# Altium project ESP-3D.PrjPcb
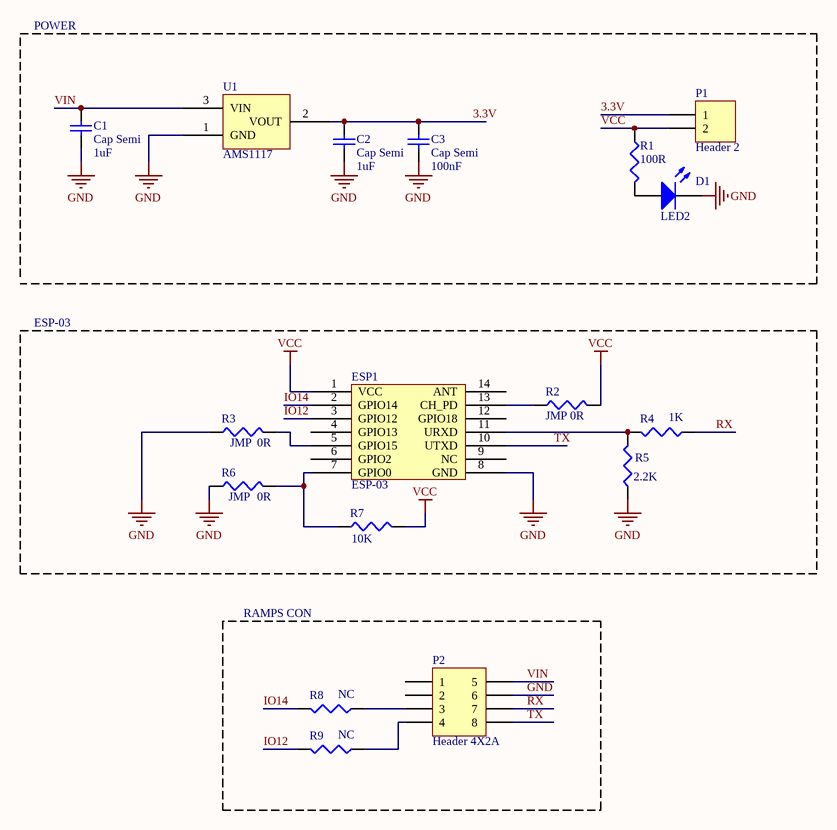
[diagram p0: ESP-3D.SchDoc]
1 sheet, 17 parts. Net scope: global (net labels, ports and power ports of the same name join across sheets).
Board files: ESP-3D.PcbDoc, Panelizado.PcbDoc

## Sheet ESP-3D.SchDoc
size A4

### Parts
C1  Cap Semi  value 1uF  [1608[0603]]
C2  Cap Semi  value 1uF  [1608[0603]]
C3  Cap Semi  value 100nF  [1608[0603]]
D1  LED2  [C0805]
ESP1  ESP-03  [ESP-03]
P1  Header 2  [HDR1X2]
P2  Header 4X2A  [HDR2X4_CEN]
R1  value 100R  [J1-0603]  (hidden comment: JMP)
R2  JMP  value 0R  [J1-0603]
R3  JMP  value 0R  [J1-0603]
R4  value 1K  [J1-0603]  (hidden comment: JMP)
R5  value 2.2K  [J1-0603]  (hidden comment: JMP)
R6  JMP  value 0R  [J1-0603]
R7  value 10K  [J1-0603]  (hidden comment: P)
R8  value NC  [J1-0603]  (hidden comment: JMP)
R9  value NC  [J1-0603]  (hidden comment: JMP)
U1  AMS1117  [SOT223_N]

### Blocks framed on the sheet
ESP-03: ESP1 R2-R7
RAMPS CON: P2 R8 R9

### Nets
GND: C1.1 C2.1 C3.1 D1.2(K) ESP1.8(GND) P2.6 R3.1 R5.1 R6.1 U1.1(GND)
VCC: ESP1.1(VCC) P1.2 R1.1 R2.2 R7.2
3.3V: C2.2 C3.2 P1.1 U1.2(VOUT)
IO12: ESP1.3(GPIO12) R9.2
IO14: ESP1.2(GPIO14) R8.2
RX: P2.7 R4.1
TX: ESP1.10(UTXD) P2.8
VIN: C1.2 P2.5 U1.3(VIN)
NetD1_1: D1.1(A) R1.2
NetESP1_5: ESP1.5(GPIO15) R3.2
NetESP1_7: ESP1.7(GPIO0) R6.2 R7.1
NetESP1_11: ESP1.11(URXD) R4.2 R5.2
NetESP1_13: ESP1.13(CH_PD) R2.1
NetP2_3: P2.3 R8.1
NetP2_4: P2.4 R9.1

Not connected (* = marked no-connect by the designer): ESP1 4(GPIO13) 6(GPIO2) 9(NC) 12(GPIO18) 14(ANT); P2 1 2

### Notes on the sheet
- POWER

### Library data of the parts
C1-C3 = Cap Semi: Capacitor (Semiconductor SIM Model); Published: 8-Jun-2000; LatestRevisionDate: 29-May-2009; LatestRevisionNote: IPC-7351 Footprint Added.; PackageReference: C1206; Publisher: Altium Limited; PackageDescription: Chip Capacitor
D1 = LED2: Typical RED, GREEN, YELLOW, AMBER GaAs LED; Published: 8-Jun-2000; LatestRevisionDate: 17-Jul-2002; LatestRevisionNote: Re-released for DXP Platform.; PackageVersion: Feb-2002; PackageReference: 3.2X1.6X1.1; Publisher: Altium Limited; PackageDescription: SM LED; 2 Flat Leads
P1 = Header 2: Header, 2-Pin; LatestRevisionDate: 17-Jul-2002; LatestRevisionNote: Re-released for DXP Platform.; Publisher: Altium Limited
P2 = Header 4X2A: Header, 4-Pin, Dual row; LatestRevisionDate: 17-Jul-2002; LatestRevisionNote: Re-released for DXP Platform.; Publisher: Altium Limited
R1-R9 = Res3: Resistor; Published: 8-Jun-2000; LatestRevisionDate: 29-May-2009; LatestRevisionNote: IPC-7351 Footprint Added.; PackageReference: J1-0603; Publisher: Altium Limited; PackageDescription: Chip Resistor